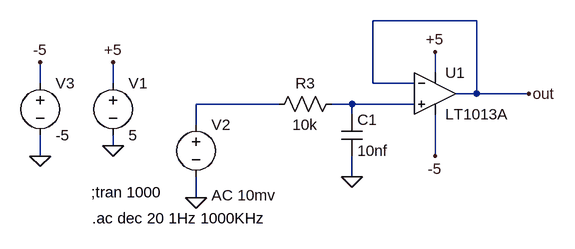
[diagram p0: schematic conditioning.asc]
conditioning.asc, the LTspice schematic file:
Version 4
SHEET 1 880 680
WIRE 432 32 272 32
WIRE 368 112 368 80
WIRE -240 128 -240 96
WIRE -128 128 -128 96
WIRE 272 128 272 32
WIRE 336 128 272 128
WIRE 432 144 432 32
WIRE 432 144 400 144
WIRE 512 144 432 144
WIRE 128 160 0 160
WIRE 240 160 208 160
WIRE 336 160 240 160
WIRE 240 176 240 160
WIRE 0 192 0 160
WIRE -128 224 -128 208
WIRE -240 240 -240 208
WIRE 368 240 368 176
WIRE 240 272 240 240
WIRE 240 272 224 272
WIRE 0 304 0 272
FLAG -128 224 0
FLAG 240 272 0
FLAG -128 96 +5
FLAG 0 304 0
FLAG 512 144 out
FLAG -240 240 0
FLAG -240 96 -5
FLAG 368 80 +5
FLAG 368 240 -5
SYMBOL Opamps\\LT1013A 368 80 R0
SYMATTR InstName U1
SYMBOL voltage -128 112 R0
WINDOW 123 24 124 Left 2
WINDOW 39 0 0 Left 2
SYMATTR InstName V1
SYMATTR Value 5
SYMBOL res 112 176 R270
WINDOW 0 32 56 VTop 2
WINDOW 3 0 56 VBottom 2
SYMATTR InstName R3
SYMATTR Value 10k
SYMBOL cap 224 176 R0
SYMATTR InstName C1
SYMATTR Value 10nf
SYMBOL voltage 0 176 R0
WINDOW 123 24 124 Left 2
WINDOW 39 0 0 Left 2
SYMATTR InstName V2
SYMATTR Value ""
SYMATTR Value2 AC 10mv
SYMBOL voltage -240 112 R0
WINDOW 123 0 0 Left 2
WINDOW 39 0 0 Left 2
SYMATTR InstName V3
SYMATTR Value -5
TEXT -162 296 Left 2 !;tran 1000
TEXT -160 336 Left 2 !.ac dec 20 1Hz 1000KHz

The netlist it stands for:
* conditioning.asc
XU1 N002 out +5 -5 out LT1013A  ; pins In+ In- V+ V- OUT
V1 +5 0 5
R3 N001 N002 10k
C1 N002 0 10nf
V2 N001 0 AC 10mv
V3 -5 0 -5
;tran 1000
.ac dec 20 1Hz 1000KHz
.backanno
.end